# EAGLE design TiLDA Mk2 LCD Breakout v0.1 (EAGLE 6.1)
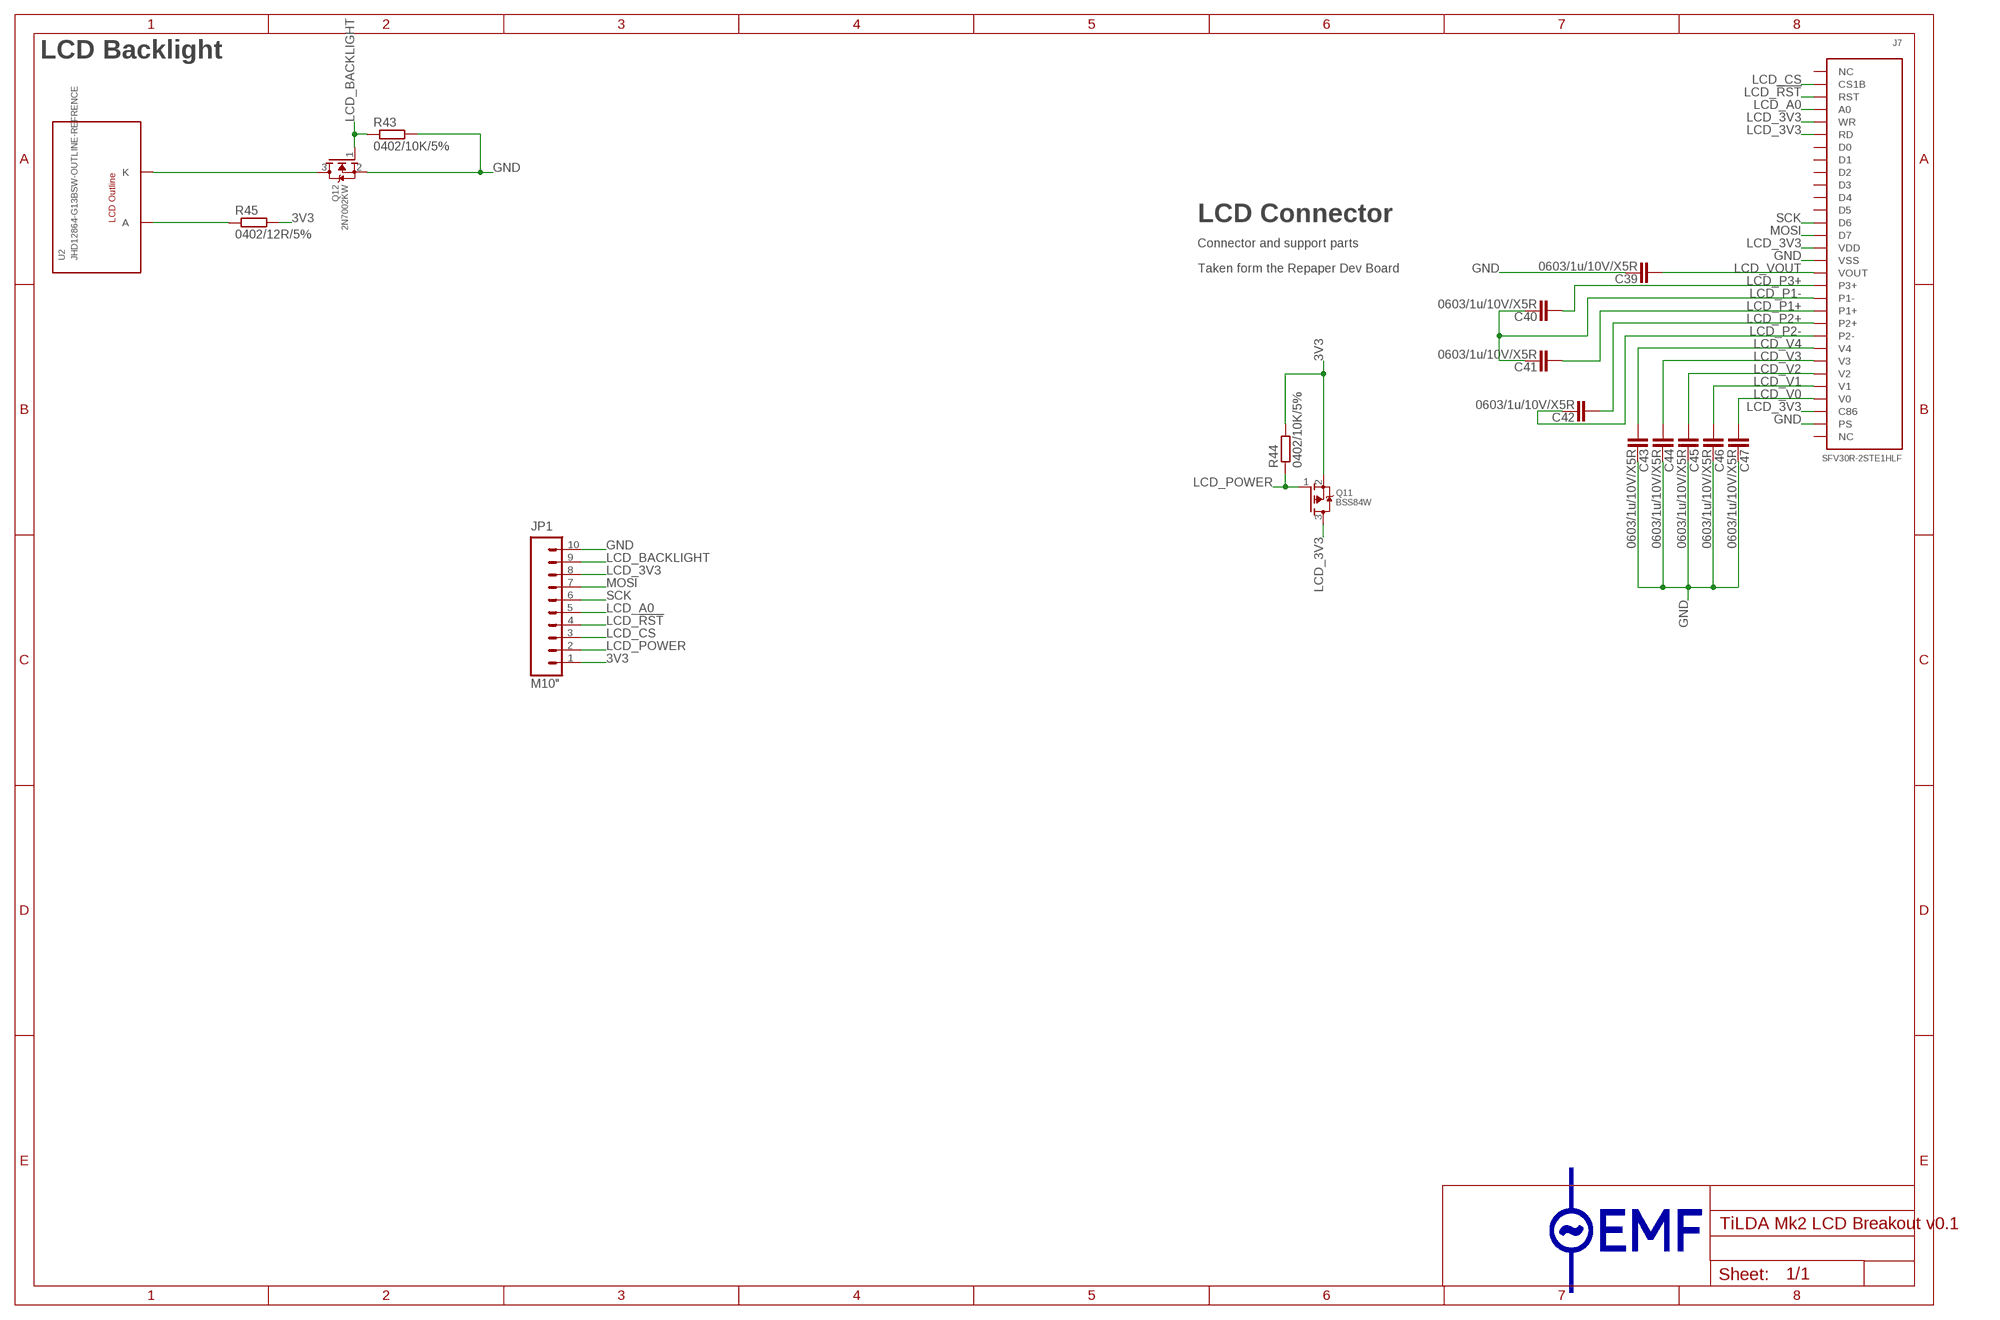
[diagram p0: schematic, sheet 1]

## Parts
C39  0603/1u/10V/X5R  C-EUC0603-ROUND  [C0603-ROUND]
C40  0603/1u/10V/X5R  C-EUC0603-ROUND  [C0603-ROUND]
C41  0603/1u/10V/X5R  C-EUC0603-ROUND  [C0603-ROUND]
C42  0603/1u/10V/X5R  C-EUC0603-ROUND  [C0603-ROUND]
C43  0603/1u/10V/X5R  C-EUC0603-ROUND  [C0603-ROUND]
C44  0603/1u/10V/X5R  C-EUC0603-ROUND  [C0603-ROUND]
C45  0603/1u/10V/X5R  C-EUC0603-ROUND  [C0603-ROUND]
C46  0603/1u/10V/X5R  C-EUC0603-ROUND  [C0603-ROUND]
C47  0603/1u/10V/X5R  C-EUC0603-ROUND  [C0603-ROUND]
J7  SFV30R-2STE1HLF  JHD12863-G13BSW-CONNECTOR-30WAY-BOTTOM  [FPC30-WAY-BOTTOM]
JP1  M10"  [1X10]
LOGO1  EMFLOGO-SYMBOL  [EMFLOGO1]
Q11  BSS84W  MOSFET-P-SC70-3  [SC70-3-R]
Q12  2N7002KW  MOSFET-NSC70-3  [SC70-3-R]
R43  0402/10K/5%  R-EU_R0402-ARDUINO-ROUND  [R0402-ARDUINO-ROUND]
R44  0402/10K/5%  R-EU_R0402-ARDUINO-ROUND  [R0402-ARDUINO-ROUND]
R45  0402/12R/5%  R-EU_R0402-ARDUINO-ROUND  [R0402-ARDUINO-ROUND]
U2  JHD12864-G13BSW-OUTLINE-REFRENCE  [JHD12864-G13BSW-OUTLINE-REF]

## Nets
3V3: JP1.1 Q11.2(S) R44.2 R45.2
GND: C39.1 C43.1 C44.1 C45.1 C46.1 C47.1 J7.16(VSS) J7.29(PS) J7.M1(VSS) J7.M2(VSS) JP1.10 Q12.2(S) R43.2
LCD_3V3: J7.5(WR) J7.6(RD) J7.15(VDD) J7.28(C86) JP1.8 Q11.3(D)
LCD_!RST: J7.3(RST) JP1.4
LCD_A: R45.1 U2.A
LCD_A0: J7.4(A0) JP1.5
LCD_BACKLIGHT: JP1.9 Q12.1(G) R43.1
LCD_CS: J7.2(CS1B) JP1.3
LCD_K: Q12.3(D) U2.K
LCD_P1+: C41.2 J7.20(P1+)
LCD_P1-: C40.1 C41.1 J7.19(P1-)
LCD_P2+: C42.2 J7.21(P2+)
LCD_P2-: C42.1 J7.22(P2-)
LCD_P3+: C40.2 J7.18(P3+)
LCD_POWER: JP1.2 Q11.1(G) R44.1
LCD_V0: C47.2 J7.27(V0)
LCD_V1: C46.2 J7.26(V1)
LCD_V2: C45.2 J7.25(V2)
LCD_V3: C44.2 J7.24(V3)
LCD_V4: C43.2 J7.23(V4)
LCD_VOUT: C39.2 J7.17(VOUT)
MOSI: J7.14(D7) JP1.7
SCK: J7.13(D6) JP1.6
Unconnected: J7.1(NC) J7.7(D0) J7.8(D1) J7.9(D2) J7.10(D3) J7.11(D4) J7.12(D5) J7.30(NC)

## Notes on the sheet
- LCD Backlight
- LCD Connector
- Connector and support parts
- Taken form the Repaper Dev Board

## Library data of the parts
C39-C47 = TiLDA Mk2 Parts:C-EU: CAPACITOR, European symbol
J7 = TiLDA Mk2 Parts:JHD12863-G13BSW-CONNECTOR
JP1 = TiLDA Mk2 Parts:M10: Header 10 Standard 10-pin 0.1" header. Use with straight break away headers (SKU : PRT-00116), right angle break away headers (PRT-00553), swiss pins (PRT-00743), machine pins (PRT-00117), and female headers (PRT-00115).
LOGO1 = TiLDA Mk2 Parts:EMFLOGO
Q11 = TiLDA Mk2 Parts:MOSFET-P
Q12 = TiLDA Mk2 Parts:MOSFET-N: N-Channel Mosfet 2N7002E - 60V 260mA SOT23 [Digikey: 2N7002ET1GOSTR-ND] - REEL BSH103 - 30V 850mA SOT23 [Digikey: 568-5013-1-ND]
R43-R45 = TiLDA Mk2 Parts:R-EU_: RESISTOR, European symbol
U2 = TiLDA Mk2 Parts:JHD12864-G13BSW-OUTLINE

## Net classes
0 default: width 0.15 mm, drill 0.3 mm, clearance 0.15 mm

## Board
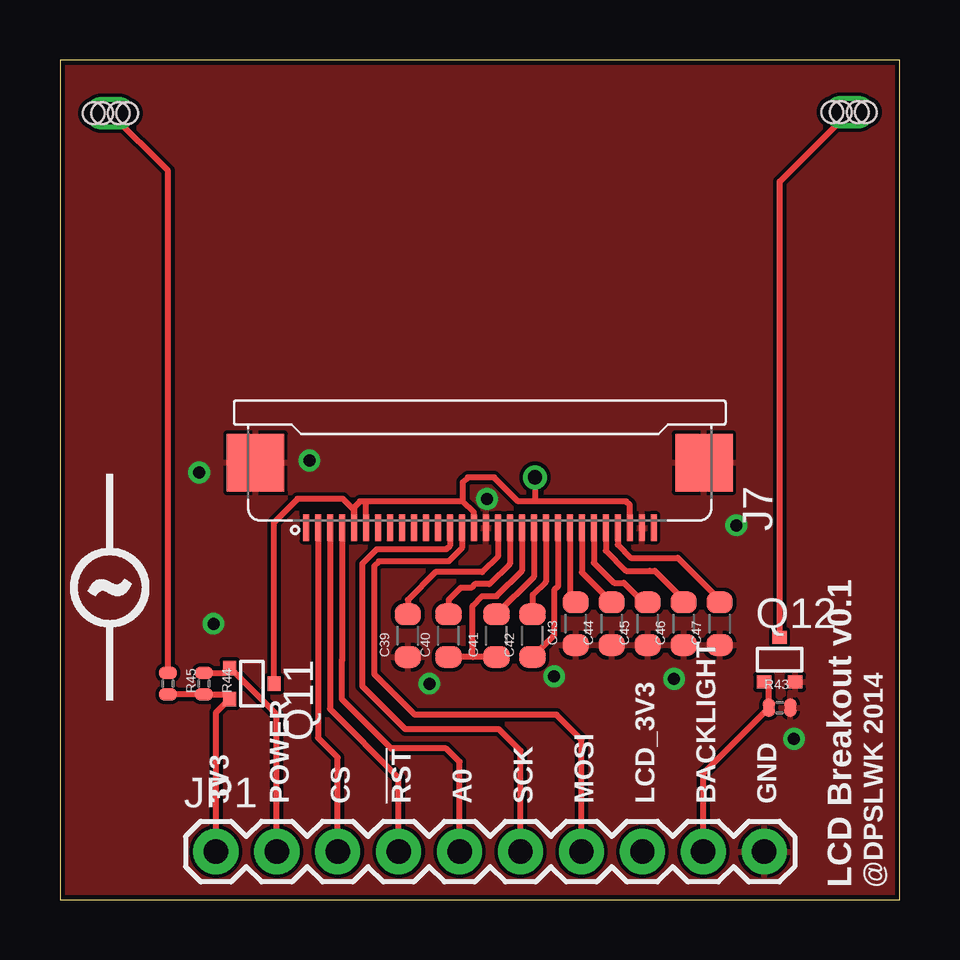
[diagram p1: board, top side]
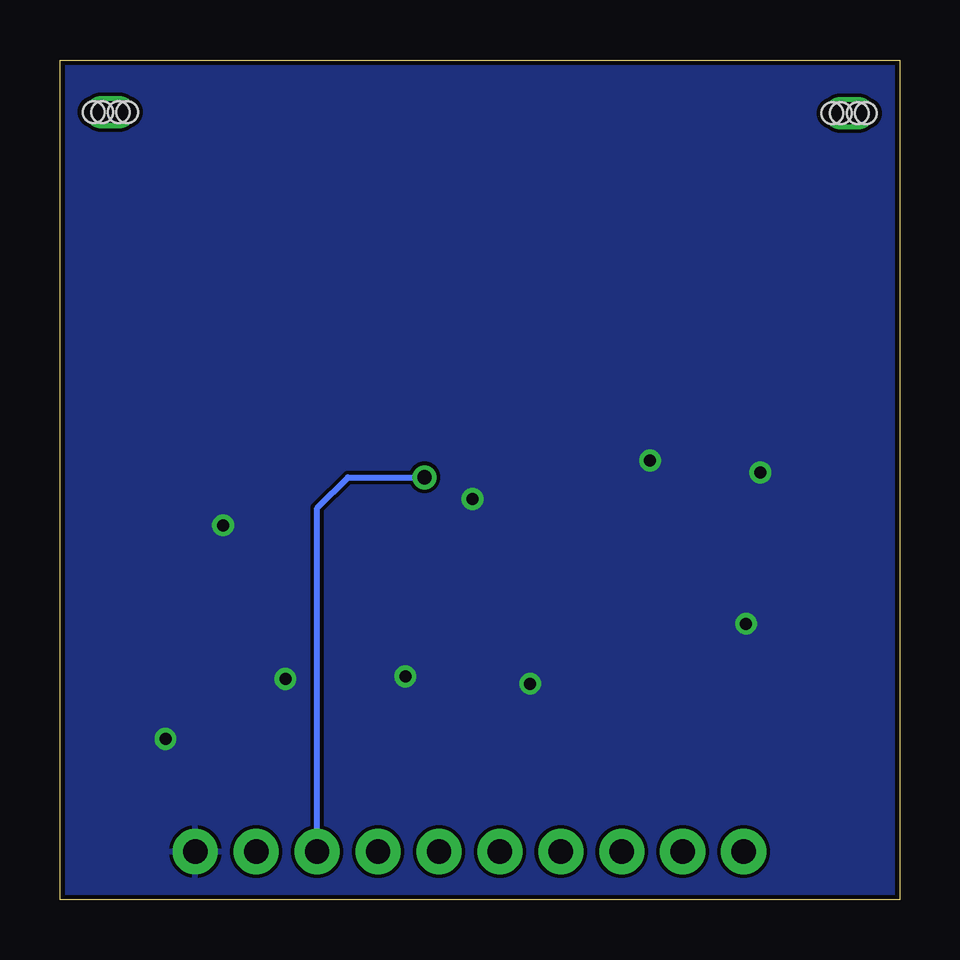
[diagram p2: board, bottom side, seen from below]

Size 35 x 35 mm. Coordinates in mm from the lower left corner, seen from the top.
Outline: 0,0 35,0 35,35 0,35 0,0
Copper layers (1*2*15*16): Top 0.035mm / dielectric 0.2mm / Route2 0.035mm / dielectric 1mm / Route15 0.035mm / dielectric 0.2mm / Bottom 0.035mm
Design rules: minimum track width 0.15mm, minimum drill 0.3mm, track to track 0.15mm, track to pad 0.15mm, pad to pad 0.15mm, via to via 0.15mm, smd to smd 0.15mm, copper to edge 0.2mm, drill to drill 12mil, minimum pad ring 8mil, minimum via ring 8mil, stop-mask expansion 2mil, vias tented up to drill 25mil, thermal gap 0.15mm

### Footprints (pad centres in the part's own frame; a part is rotated, then mirrored left to right if it is on the bottom)
C0603-ROUND = smd 0.898 x 1.1: 1 -0.889,0; 2 0.889,0
FPC30-WAY-BOTTOM = smd 0.25 x 1.1: 1 -7.25,-2.8; 2 -6.75,-2.8; 3 -6.25,-2.8; 4 -5.75,-2.8; 5 -5.25,-2.8; 6 -4.75,-2.8; 7 -4.25,-2.8; 8 -3.75,-2.8; 9 -3.25,-2.8; 10 -2.75,-2.8; 11 -2.25,-2.8; 12 -1.75,-2.8; 13 -1.25,-2.8; 14 -0.75,-2.8; 15 -0.25,-2.8; 16 0.25,-2.8; 17 0.75,-2.8; 18 1.25,-2.8; 19 1.75,-2.8; 20 2.25,-2.8; 21 2.75,-2.8; 22 3.25,-2.8; 23 3.75,-2.8; 24 4.25,-2.8; 25 4.75,-2.8; 26 5.25,-2.8; 27 5.75,-2.8; 28 6.25,-2.8; 29 6.75,-2.8; 30 7.25,-2.8 | smd 2.4 x 2.4: M1 9.35,-0.09; M2 -9.35,-0.09
1X10 = drill 1.016 pad 1.88: 1 0,0; 2 2.54,0; 3 5.08,0; 4 7.62,0; 5 10.16,0; 6 12.7,0; 7 15.24,0; 8 17.78,0; 9 20.32,0; 10 22.86,0
SC70-3-R = smd 0.6 x 0.55: 1 -0.65,-0.925; 2 0.65,-0.925; 3 0,0.925
R0402-ARDUINO-ROUND = smd 0.508 x 0.762: 1 -0.445,0; 2 0.445,0
JHD12864-G13BSW-OUTLINE-REF = drill 0.9 long: A 16.6,1.3; K 47.4,1.35 | hole 0.9: 15.9,1.3; 17.3,1.3; 47.05,1.35; 48.1,1.35; 16.25,1.3; 16.95,1.3; 46.7,1.35; 47.75,1.35

### Placement (x,y rotation side)
C39  14.5,11 90 top
C40  16.2,11 90 top
C41  18.2,11 90 top
C42  19.7,11 90 top
C43  21.5,11.5 90 top
C44  23,11.5 90 top
C45  24.5,11.5 90 top
C46  26,11.5 90 top
C47  27.5,11.5 90 top
J7  17.5,18.3 0 top
JP1  6.5,2 0 top
LOGO1  2.07,12.97 0 top
Q11  8,9 270 top
Q12  30,10 0 top
R43  30,8 0 top
R44  6,9 270 top
R45  4.5,9 270 top
U2  -14.5,31.48 0 top

### Tracks (layer width: path | path; a pad name or v marks a point on that pad's centre or on a via)
3V3
  Top 0.254: JP1.1 6.5,7.8 7.05,8.35 | 7.05,8.35 7.1,8.4 | 7.05,8.35 Q11.2 6.87,8.56 R44.2 R45.2
GND  (via drill 0.5)
  other vias: 17.8,16.7 6.4,11.5 30.6,6.7 20.6,9.3 25.6,9.2 28.2,15.6 5.8,17.8 10.4,18.3 15.4,9
  pour Top: 0,0 35,0 35,35 0,35
  pour Bottom: 0,0 35,0 35,35 0,35
LCD_3V3  (via drill 0.6)
  Top 0.254: J7.28 23.75,16.45 23.6,16.6 19.8,16.6 | 19.8,16.6 19.1,16.6 18.1,17.6 17,17.6 16.8,17.4 16.8,16.6 | 16.8,16.6 12.8,16.6 | 12.8,16.6 12.5,16.6 12.25,16.35 J7.5 12.25,16.25 11.8,16.7 9.9,16.7 8.93,15.72 Q11.3 | J7.6 12.75,16.55 12.8,16.6 | J7.15 17.25,16.15 16.8,16.6 | v19.8,17.6 19.8,16.6
  Bottom 0.254: JP1.8 24.28,16.32 23,17.6 v19.8,17.6
LCD_!RST
  Top 0.254: J7.3 11.25,7.95 14.12,5.08 JP1.4
LCD_A
  Top 0.254: R45.1 4.5,30.38 U2.A
LCD_A0
  Top 0.254: J7.4 11.75,10 11.75,9.95 11.75,8.35 13.8,6.3 16.1,6.3 16.66,5.74 JP1.5
LCD_BACKLIGHT
  Top 0.254: JP1.9 26.82,5.26 R43.1 29.55,8.87 Q12.1
LCD_CS
  Top 0.254: J7.2 10.75,6.75 11.58,5.92 JP1.3
LCD_K
  Top 0.254: Q12.3 30,29.93 U2.K
LCD_P1+
  Top 0.254: J7.20 19.75,13.45 C41.2
LCD_P1-
  Top 0.254: 17.2,10.11 C40.1 | C41.1 17.2,10.11 | 17.2,10.11 17.2,12.25 17.6,12.65 18.2,12.65 19.25,13.7 J7.19
LCD_P2+
  Top 0.254: J7.21 20.25,13.25 19.7,12.7 C42.2
LCD_P2-
  Top 0.254: J7.22 20.75,13.05 20.6,12.9 20.6,11.01 C42.1
LCD_P3+
  Top 0.254: J7.18 18.75,14 17.9,13.15 17.3,13.15 17.15,13 16.7,13 16.2,12.5 C40.2
LCD_POWER
  Top 0.254: R44.1 6.87,9.44 Q11.1 7.1,9.65 9.04,7.71 JP1.2
LCD_V0
  Top 0.254: J7.27 23.25,14.8 23.8,14.25 25.75,14.25 27.5,12.5 C47.2
LCD_V1
  Top 0.254: J7.26 22.75,14.55 23.6,13.7 24.59,13.7 24.8,13.7 26,12.5 C46.2
LCD_V2
  Top 0.254: J7.25 22.25,14.04 22.26,14.04 23.1,13.2 23.5,13.2 24.3,12.4 C45.2
LCD_V3
  Top 0.254: J7.24 21.75,13.64 C44.2
LCD_V4
  Top 0.254: J7.23 21.25,12.64 C43.2
LCD_VOUT
  Top 0.254: J7.17 18.25,14.3 17.6,13.65 15.65,13.65 14.5,12.5 C39.2
MOSI
  Top 0.254: J7.14 16.75,14.65 16.2,14.1 13.3,14.1 13.1,13.9 13.1,9.4 14.8,7.7 20.7,7.7 21.74,6.66 JP1.7
SCK
  Top 0.254: J7.13 16.25,14.75 16.1,14.6 13.2,14.6 12.6,14 12.6,8.9 14.4,7.1 18.3,7.1 19.2,6.2 JP1.6

### Text on the board
tPlace: 3V3 | POWER | CS | !RST | A0 | SCK | MOSI | LCD_3V3 | BACKLIGHT | GND | LCD Breakout v0.1 | @DPSLWK 2014